# Altium project 175-00060, rev2, NRES Temp Meas, 8-Chan RTD.PrjPcb
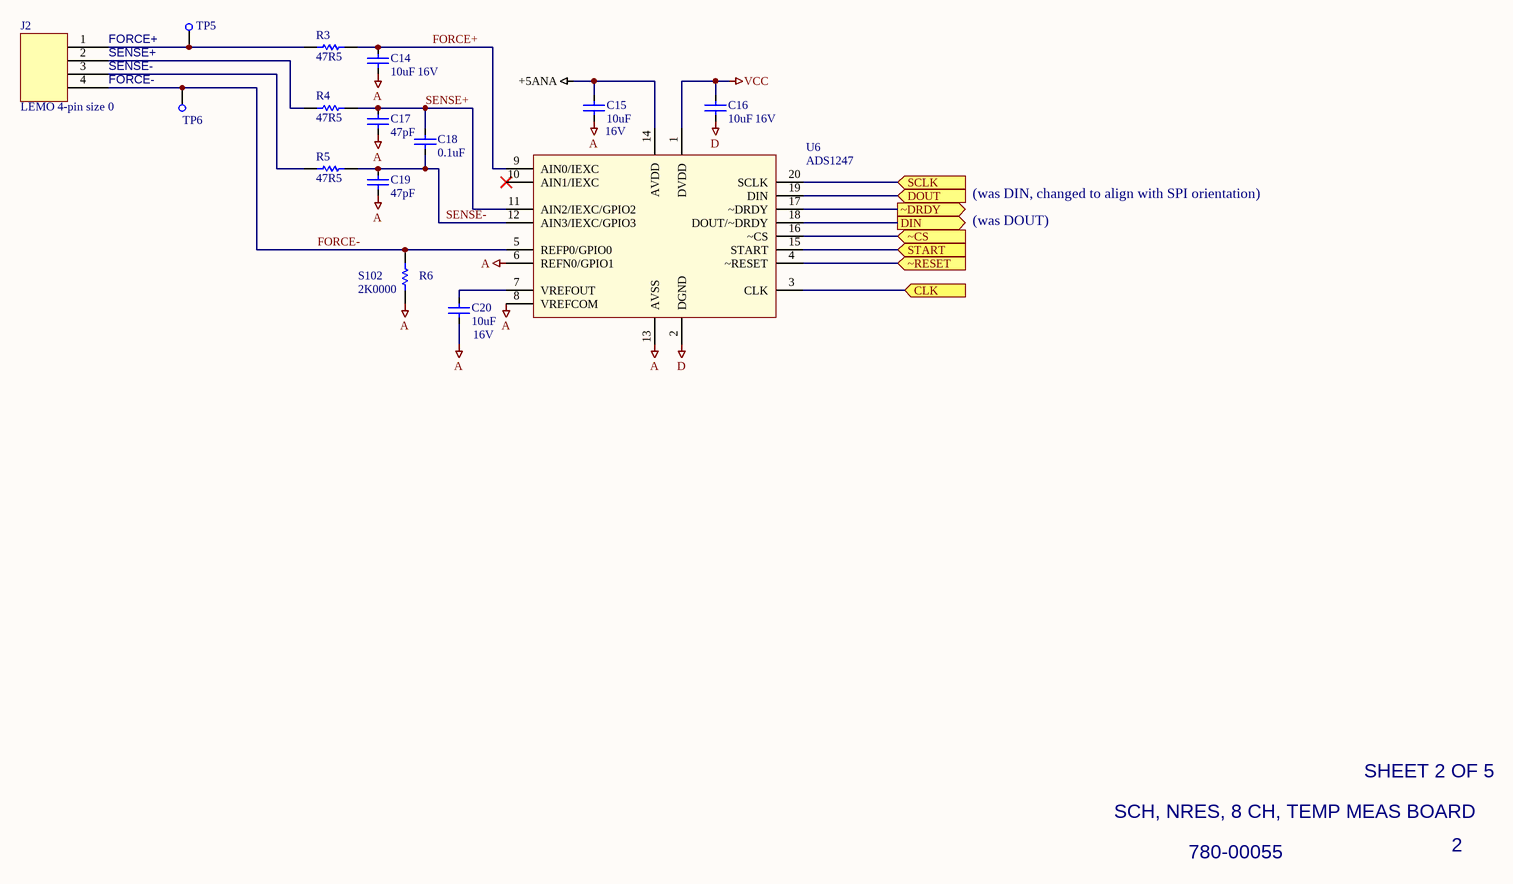
[diagram p0: 780-00055, rev2, Pg2, SCH, NRES Temp Meas, 8-Chan RTD .SchDoc]
4 sheets, 79 parts. Net scope: flat (ports and power ports of the same name join across sheets).
Board file: 175-00060, rev2, PCB, NRES RTD_TEC Board.PcbDoc
Sheets:
  780-00055, rev2, Pg2, SCH, NRES Temp Meas, 8-Chan RTD .SchDoc
  780-00055, rev2, Pg3, SCH, NRES Temp Meas, 8-Chan RTD .SchDoc
  780-00055, rev2, Pg4, SCH, NRES Temp Meas, 8-Chan RTD .SchDoc
  780-00055, rev2, Pg5, SCH, NRES Temp Meas, 8-Chan RTD .SchDoc

## Sheet 780-00055, rev2, Pg2, SCH, NRES Temp Meas, 8-Chan RTD .SchDoc
size B; PageSetup: Record=PageOptions|CenterHorizontal=True|CenterVertical=True|PrintScale=1.12|XCorrection=1.00|YCorrection=1.00|PrintKind=0|BorderSize=5000000|LeftOffset=0|BottomOffset=0|Orientation=2|PaperLength=1000|PaperWidth=1000|Scale=100|PaperSource=15|PrintQuality=600|MediaType=1|DitherType=10|PrintScaleMode=1|PaperKind=Tabloid|PaperIndex=3

### Parts
C14  16V  value 10uF  [SMD_0805]
C15  16V  value 10uF  [SMD_0805]
C16  16V  value 10uF  [SMD_0805]
C17  value 47pF  [SMD_0805]  (hidden comment: Cap SMD)
C18  value 0.1uF  [SMD_0805]  (hidden comment: Cap SMD)
C19  value 47pF  [SMD_0805]  (hidden comment: Cap SMD)
C20  16V  value 10uF  [SMD_0805]
J2  LEMO 4-pin size 0  [LEMO Size 0, 4-pin PCB]
R3  value 47R5  [SMD_0805]  (hidden comment: Res 0805)
R4  value 47R5  [SMD_0805]  (hidden comment: Res 0805)
R5  value 47R5  [SMD_0805]  (hidden comment: Res 0805)
R6  S102  value 2K0000  [Vishay S102 series]
TP5  Test point  [PAD_80D_052H]  (value not drawn)
TP6  Test point  [PAD_80D_052H]  (value not drawn)
U6  ADS1247  [TSSOP20]

### Ports
CLK (in), DIN (out), DOUT (in), SCLK (in), START (in), ~CS (in), ~DRDY (out), ~RESET (in)

### Nets
+5ANA: C15.2 U6.14(AVDD)
A: C14.1 C15.1 C17.1 C19.1 C20.1 R6.1 U6.6(REFN0/GPIO1) U6.8(VREFCOM) U6.13(AVSS)
D: C16.1 U6.2(DGND)
VCC: C16.2 U6.1(DVDD)
DOUT: U6.19(DIN) ; port DOUT
FORCE+: C14.2 R3.2 U6.9(AIN0/IEXC)
FORCE-: J2.4(S32) R6.2 TP6.1(TP) U6.5(REFP0/GPIO0)
SCLK: U6.20(SCLK) ; port SCLK
SENSE+: C17.2 C18.2 R4.2 U6.11(AIN2/IEXC/GPIO2)
SENSE-: C18.1 C19.2 R5.2 U6.12(AIN3/IEXC/GPIO3)
START: U6.15(START) ; port START
~DRDY: U6.17(~DRDY) ; port ~DRDY
NetC20_2: C20.2 U6.7(VREFOUT)
NetJ2_1: J2.1(S29) R3.1 TP5.1(TP)
NetJ2_2: J2.2(S30) R4.1
NetJ2_3: J2.3(S31) R5.1
NetU6_3: U6.3(CLK) ; port CLK
NetU6_4: U6.4(~RESET) ; port ~RESET
NetU6_16: U6.16(~CS) ; port ~CS
NetU6_18: U6.18(DOUT/~DRDY) ; port DIN

Not connected (* = marked no-connect by the designer): U6 10(AIN1/IEXC)*

### Notes on the sheet
- FORCE+
- SENSE+
- SENSE-
- FORCE-
- (was DIN, changed to align with SPI orientation)
- (was DOUT)
- SCH, NRES, 8 CH, TEMP MEAS BOARD
- SHEET 2 OF 5
- 780-00055
- 2

### Library data of the parts
C14-C16 C20 = Cap SMD: Capacitor; LCO p/n: 120-00007
C17 C19 = Cap SMD: Capacitor; LCO p/n: 120-00056
C18 = Cap SMD: Capacitor; LCO p/n: 120-00002
J2 = LEMO Size 0, 4 pin, PCB: LCO p/n: 125-00372
R3-R5 = Res SMD: Resistor 0805; Manufacturer: Vishay/Dale; Manuf p/n: CRCW080547R5FKEA; Vendor: DIGIKEY; Vendor p/n: 541-47R5CCT-ND; Vendor Mult.: 10; LCO p/n: 181-047R5; COST: 0.09
R6 = RES TH Radial: Vishay Foil Resistor; LCO p/n: 180-00011
TP5 TP6 = Test point: Manufacturer: Keystone; Manuf p/n: 1249; Vendor: Bisco Ind.; LCO p/n: 125-00013; Vendor p/n: 1249; COST: 0.18; VALUE: Test point
U6 = ADS1247: 24bit ADC for Temp Sensors; Manufacturer: TI; Manuf p/n: ADS1247IPW; LCO p/n: 150-00106; Vendor: DK; Vendor p/n: 296-24293-5-ND

## Sheet 780-00055, rev2, Pg3, SCH, NRES Temp Meas, 8-Chan RTD .SchDoc
size B; PageSetup: Record=PageOptions|CenterHorizontal=True|CenterVertical=True|PrintScale=1.12|XCorrection=1.00|YCorrection=1.00|PrintKind=0|BorderSize=5000000|LeftOffset=0|BottomOffset=0|Orientation=2|PaperLength=1000|PaperWidth=1000|Scale=100|PaperSource=15|PrintQuality=600|MediaType=1|DitherType=10|PrintScaleMode=1|PaperKind=Tabloid|PaperIndex=3
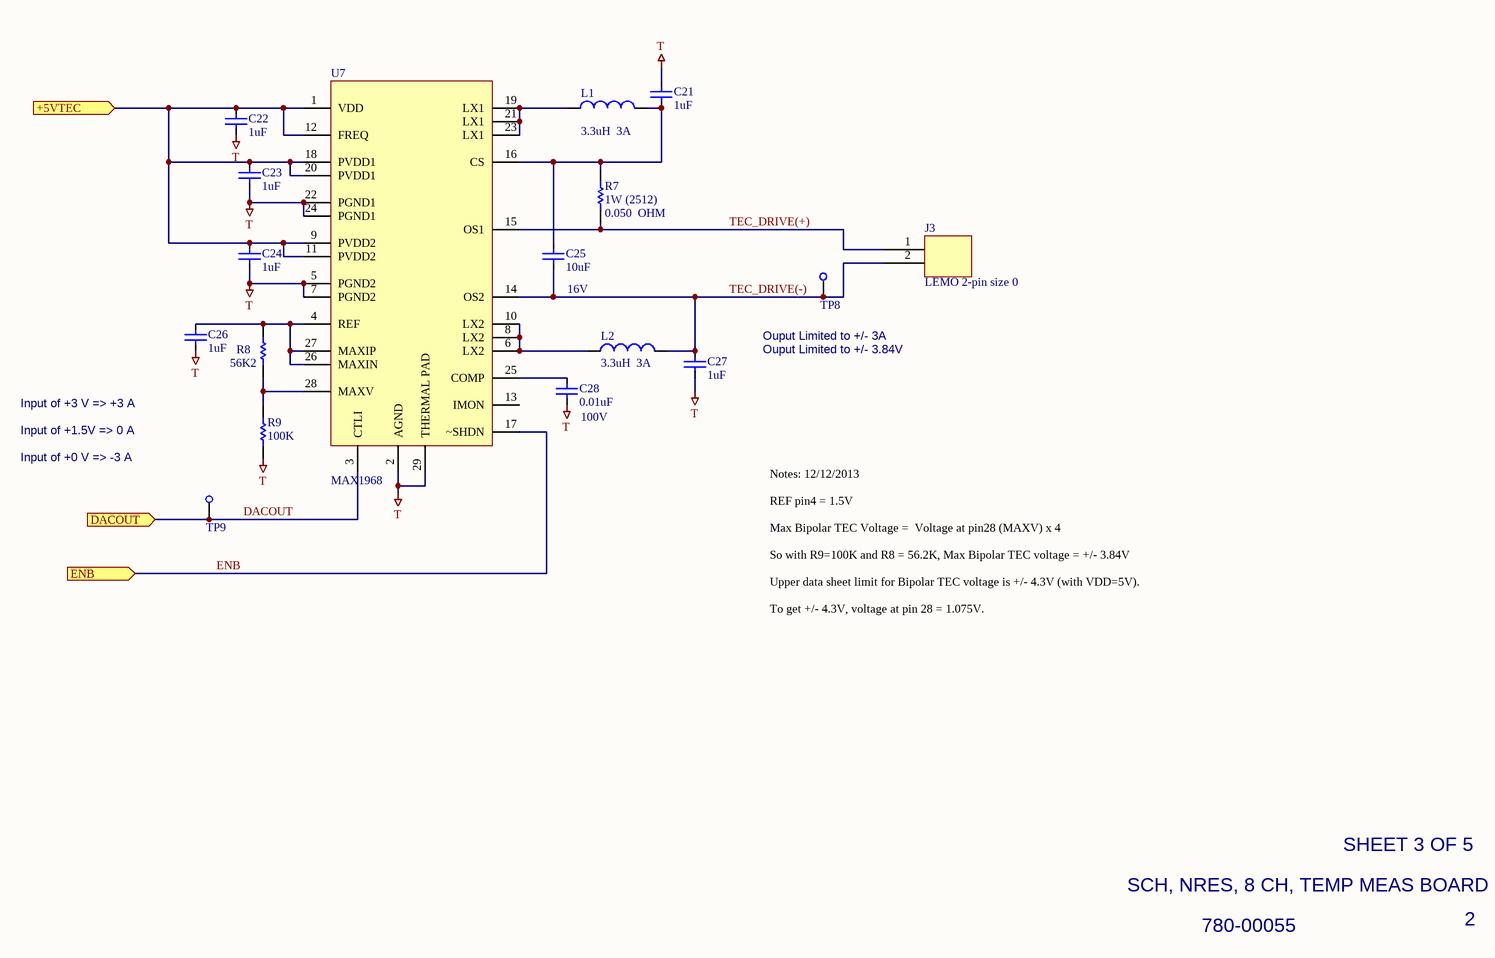
[diagram p1: 780-00055, rev2, Pg3, SCH, NRES Temp Meas, 8-Chan RTD .SchDoc]

### Parts
C21  value 1uF  [SMD_0805]  (hidden comment: Cap SMD)
C22  value 1uF  [SMD_0805]  (hidden comment: Cap SMD)
C23  value 1uF  [SMD_0805]  (hidden comment: Cap SMD)
C24  value 1uF  [SMD_0805]  (hidden comment: Cap SMD)
C25  16V  value 10uF  [SMD_0805]
C26  value 1uF  [SMD_0805]  (hidden comment: Cap SMD)
C27  value 1uF  [SMD_0805]  (hidden comment: Cap SMD)
C28  100V  value 0.01uF  [SMD_0805]
J3  LEMO 2-pin size 0  [LEMO Size 0, 2-pin PCB]
L1  value 3.3uH  3A  [SMT Inductor 7 x 7mm]  (hidden comment: 513-1481-2-ND)
L2  value 3.3uH  3A  [SMT Inductor 7 x 7mm]  (hidden comment: 513-1481-2-ND)
R7  1W (2512)  value 0.050  OHM  [6332[2512]]
R8  value 56K2  [SMD_0805]  (hidden comment: Res 0805)
R9  value 100K  [SMD_0805]  (hidden comment: Res 0805)
TP8  Test point  [PAD_80D_052H]  (value not drawn)
TP9  Test point  [PAD_80D_052H]  (value not drawn)
U7  MAX1968  [TSSOP28 Exposed Pad]

### Ports
+5VTEC (in), DACOUT (in), ENB (in)

### Nets
T: C21.2 C22.1 C23.1 C24.1 C26.1 C27.1 C28.1 R9.1 U7.2(AGND) U7.5(PGND2) U7.7(PGND2) U7.22(PGND1) U7.24(PGND1) U7.29(THERMAL_PAD)
DACOUT: TP9.1(TP) U7.3(CTLI) ; port DACOUT
ENB: U7.17(~SHDN) ; port ENB
TEC_DRIVE(+): J3.1(S29) R7.1 U7.15(OS1)
TEC_DRIVE(-): C25.1 C27.2 J3.2(S30) L2.2 TP8.1(TP) U7.14(OS2)
NetC21_1: C21.1 C25.2 L1.2 R7.2 U7.16(CS)
NetC22_2: C22.2 C23.2 C24.2 U7.1(VDD) U7.9(PVDD2) U7.11(PVDD2) U7.12(FREQ) U7.18(PVDD1) U7.20(PVDD1) ; port +5VTEC
NetC26_2: C26.2 R8.2 U7.4(REF) U7.26(MAXIN) U7.27(MAXIP)
NetC28_2: C28.2 U7.25(COMP)
NetL1_1: L1.1 U7.19(LX1) U7.21(LX1) U7.23(LX1)
NetL2_1: L2.1 U7.6(LX2) U7.8(LX2) U7.10(LX2)
NetR8_1: R8.1 R9.2 U7.28(MAXV)

Not connected (* = marked no-connect by the designer): U7 13(IMON)

### Notes on the sheet
- Ouput Limited to +/- 3A
- Ouput Limited to +/- 3.84V
- Input of +3 V => +3 A
- Input of +1.5V => 0 A
- Input of +0 V => -3 A
- Notes: 12/12/2013
  REF pin4 = 1.5V
  Max Bipolar TEC Voltage =  Voltage at pin28 (MAXV) x 4
  So with R9=100K and R8 = 56.2K, Max Bipolar TEC voltage = +/- 3.84V
  Upper data sheet limit for Bipolar TEC voltage is +/- 4.3V (with VDD=5V).
  To get +/- 4.3V, voltage at pin 28 = 1.075V.
- SCH, NRES, 8 CH, TEMP MEAS BOARD
- SHEET 3 OF 5
- 780-00055
- 2

### Library data of the parts
C21-C24 C26 C27 = Cap SMD: Capacitor; LCO p/n: 120-00006
C25 = Cap SMD: Capacitor; LCO p/n: 120-00007
C28 = Cap SMD: Capacitor; Manufacturer: Johanson; Manuf p/n: 101X15W103MV4E; Vendor: Digi-Key; Vendor p/n: 709-1325-1-ND; LCO p/n: 120-00050
J3 = LEMO Size 0, 2 pin, PCB: LCO p/n: 125-00371
L1 L2 = Inductor SMD 7 x 7mm: Inductor; Manufacturer: Coiltronics; Manuf p/n: SD7030-3R3-R; Vendor: Digi-Key; Vendor Mult.: 1; LCO p/n: 155-00007; Vendor p/n: 513-1481-2-ND; COST: 1.03
R7 = Res SMD: Manufacturer: Panasonic; Manuf p/n: ERJ-L1WKF50MU; Vendor: DIGIKEY; Vendor p/n: P50MCT-ND; Vendor Mult.: 1; LCO p/n: 180-00014; COST: 1.07
R8 = Res SMD: Resistor 0805; Manufacturer: Vishay/Dale; Manuf p/n: CRCW080556K2FKEA; Vendor: DIGIKEY; Vendor p/n: 541-56K2CCT-ND; Vendor Mult.: 10; LCO p/n: 181-05622; COST: 0.09
R9 = Res SMD: Resistor 0805; Manufacturer: Vishay/Dale; Manuf p/n: CRCW0805100KFKEA; Vendor: DIGIKEY; Vendor p/n: 541-100KCCT-ND; Vendor Mult.: 10; LCO p/n: 181-01003; COST: 0.09
TP8 TP9 = Test point: as TP5 on sheet 780-00055, rev2, Pg2, SCH, NRES Temp Meas, 8-Chan RTD ; Vendor p/n: 1249; COST: 0.18; VALUE: Test point
U7 = MAX1968: TEC Driver +/- 3A; Manufacturer: Maxim; Manuf p/n: MAX1968EUI+; LCO p/n: 150-00096; Vendor: digikey; Vendor p/n: MAX1968EUI+-ND; VALUE: MAX1968

## Sheet 780-00055, rev2, Pg4, SCH, NRES Temp Meas, 8-Chan RTD .SchDoc
size B; PageSetup: Record=PageOptions|CenterHorizontal=True|CenterVertical=True|PrintScale=1.12|XCorrection=1.00|YCorrection=1.00|PrintKind=0|BorderSize=5000000|LeftOffset=0|BottomOffset=0|Orientation=2|PaperLength=1000|PaperWidth=1000|Scale=100|PaperSource=15|PrintQuality=600|MediaType=1|DitherType=10|PrintScaleMode=1|PaperKind=Tabloid|PaperIndex=3
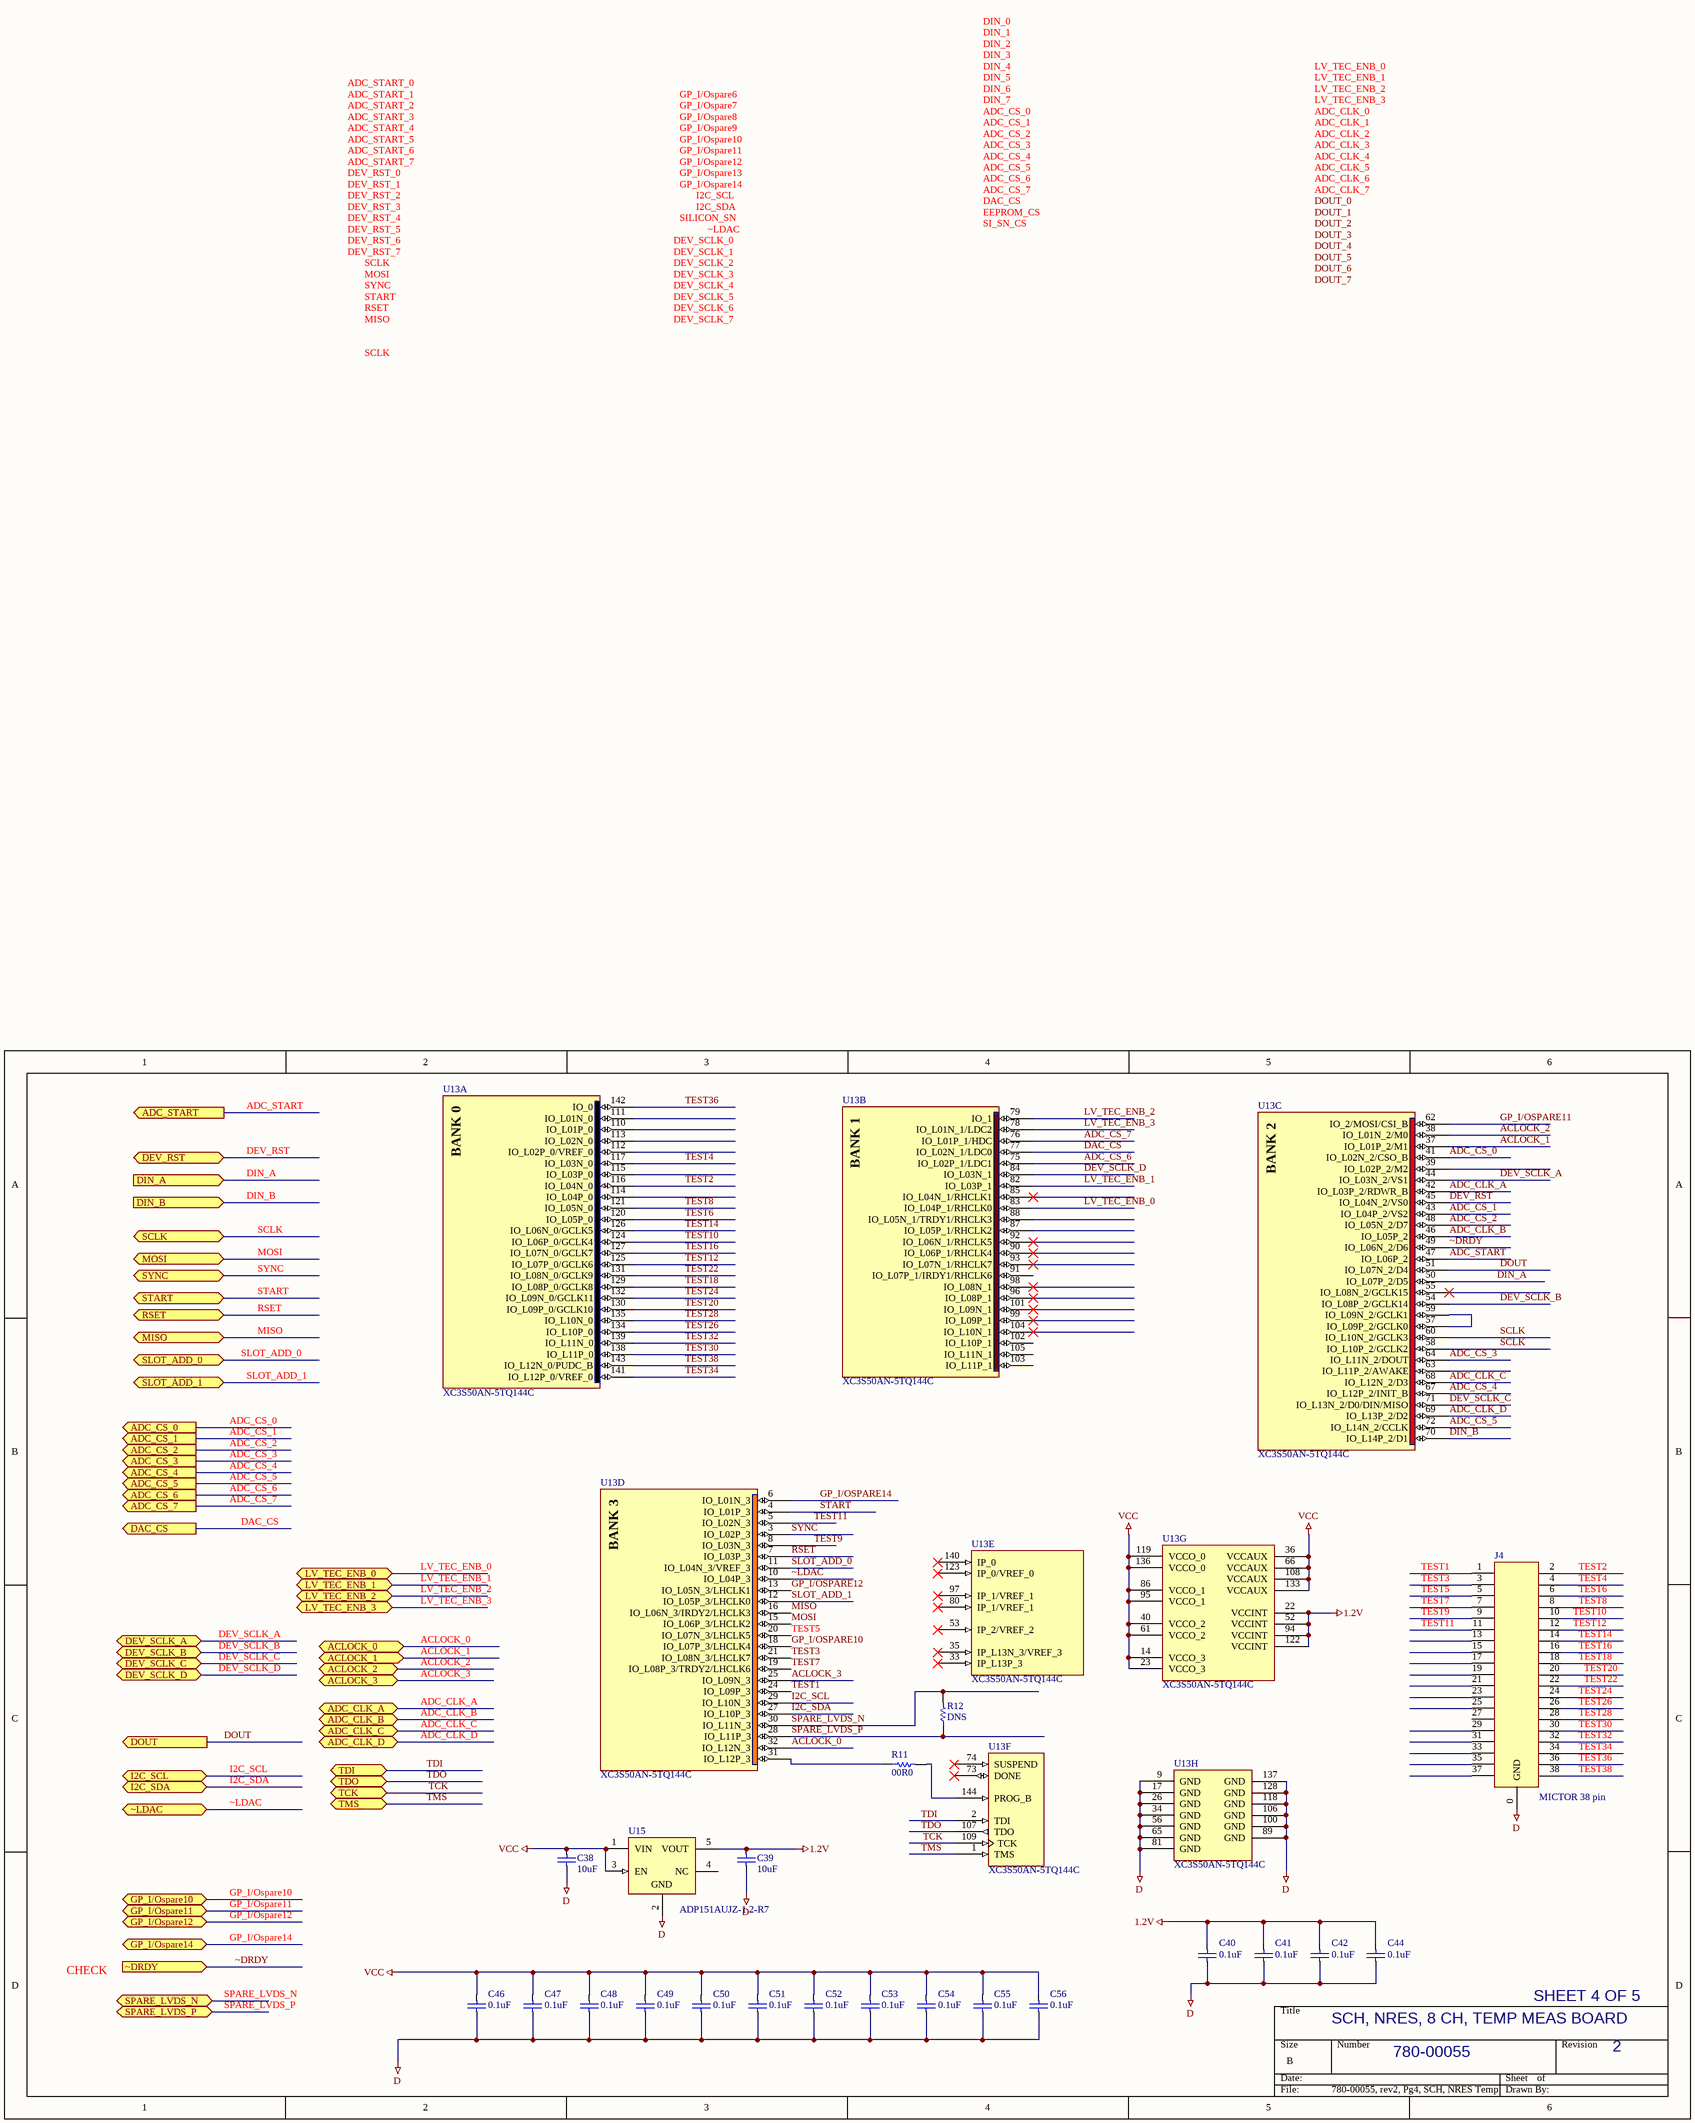
[diagram p2: 780-00055, rev2, Pg4, SCH, NRES Temp Meas, 8-Chan RTD .SchDoc]

### Parts
C38  value 10uF  [smd_0805]  (hidden comment: Cap SMD)
C39  value 10uF  [smd_0805]  (hidden comment: Cap SMD)
C40  value 0.1uF  [SMD_0805]  (hidden comment: Cap SMD)
C41  value 0.1uF  [SMD_0805]  (hidden comment: Cap SMD)
C42  value 0.1uF  [SMD_0805]  (hidden comment: Cap SMD)
C44  value 0.1uF  [SMD_0805]  (hidden comment: Cap SMD)
C46  value 0.1uF  [SMD_0805]  (hidden comment: Cap SMD)
C47  value 0.1uF  [SMD_0805]  (hidden comment: Cap SMD)
C48  value 0.1uF  [SMD_0805]  (hidden comment: Cap SMD)
C49  value 0.1uF  [SMD_0805]  (hidden comment: Cap SMD)
C50  value 0.1uF  [SMD_0805]  (hidden comment: Cap SMD)
C51  value 0.1uF  [SMD_0805]  (hidden comment: Cap SMD)
C52  value 0.1uF  [SMD_0805]  (hidden comment: Cap SMD)
C53  value 0.1uF  [SMD_0805]  (hidden comment: Cap SMD)
C54  value 0.1uF  [SMD_0805]  (hidden comment: Cap SMD)
C55  value 0.1uF  [SMD_0805]  (hidden comment: Cap SMD)
C56  value 0.1uF  [SMD_0805]  (hidden comment: Cap SMD)
J4  MICTOR 38 pin  [MICTOR 38 pin connector]
R11  value 00R0  [SMD_0805]  (hidden comment: Res 0805)
R12  value DNS  [SMD_0805]  (hidden comment: Res 0805)
U13  XC3S50AN-5TQ144C  [TQ144_N]  (parts A,B,C,D,E,F,G,H of 8)
U15  ADP151AUJZ-1.2-R7  [ADI-UJ-5_N]

### Ports
ACLOCK_0, ACLOCK_1, ACLOCK_2, ACLOCK_3, ADC_CLK_A, ADC_CLK_B, ADC_CLK_C, ADC_CLK_D, ADC_CS_0 (out), ADC_CS_1 (out), ADC_CS_2 (out), ADC_CS_3 (out), ADC_CS_4 (out), ADC_CS_5 (out), ADC_CS_6 (out), ADC_CS_7 (out), ADC_START (out), DAC_CS (out), DEV_RST, DEV_SCLK_A, DEV_SCLK_B, DEV_SCLK_C, DEV_SCLK_D, DIN_A (in), DIN_B (in), DOUT (out), GP_I/Ospare10, GP_I/Ospare11, GP_I/Ospare12, GP_I/Ospare14, I2C_SCL, I2C_SDA, LV_TEC_ENB_0, LV_TEC_ENB_1, LV_TEC_ENB_2, LV_TEC_ENB_3, MISO, MOSI, RSET, SCLK, SLOT_ADD_0, SLOT_ADD_1, SPARE_LVDS_N, SPARE_LVDS_P, START, SYNC, TCK, TDI, TDO, TMS, ~DRDY (in), ~LDAC

### Nets
1.2V: C39.2 C40.2 C41.2 C42.2 C44.2 U13.22(VCCINT) U13.52(VCCINT) U13.94(VCCINT) U13.122(VCCINT) U15.5(VOUT)
D: C38.1 C39.1 C40.1 C41.1 C42.1 C44.1 C46.1 C47.1 C48.1 C49.1 C50.1 C51.1 C52.1 C53.1 C54.1 C55.1 C56.1 J4.0(GND) U13.9(GND) U13.17(GND) U13.26(GND) U13.34(GND) U13.56(GND) U13.65(GND) U13.81(GND) U13.89(GND) U13.100(GND) U13.106(GND) U13.118(GND) U13.128(GND) U13.137(GND) U15.2(GND)
VCC: C38.2 C46.2 C47.2 C48.2 C49.2 C50.2 C51.2 C52.2 C53.2 C54.2 C55.2 C56.2 U13.14(VCCO_3) U13.23(VCCO_3) U13.36(VCCAUX) U13.40(VCCO_2) U13.61(VCCO_2) U13.66(VCCAUX) U13.86(VCCO_1) U13.95(VCCO_1) U13.108(VCCAUX) U13.119(VCCO_0) U13.133(VCCAUX) U13.136(VCCO_0) U15.1(VIN) U15.3(EN)
ACLOCK_0: U13.32(IO_L12N_3) ; port ACLOCK_0
ACLOCK_1: U13.37(IO_L01P_2/M1) ; port ACLOCK_1
ACLOCK_2: U13.38(IO_L01N_2/M0) ; port ACLOCK_2
ACLOCK_3: U13.25(IO_L09N_3) ; port ACLOCK_3
ADC_CLK_A: U13.42(IO_L03P_2/RDWR_B) ; port ADC_CLK_A
ADC_CLK_B: U13.46(IO_L05P_2) ; port ADC_CLK_B
ADC_CLK_C: U13.68(IO_L12N_2/D3) ; port ADC_CLK_C
ADC_CLK_D: U13.69(IO_L13P_2/D2) ; port ADC_CLK_D
ADC_CS_0: U13.41(IO_L02N_2/CSO_B) ; port ADC_CS_0
ADC_CS_1: U13.43(IO_L04P_2/VS2) ; port ADC_CS_1
ADC_CS_2: U13.48(IO_L05N_2/D7) ; port ADC_CS_2
ADC_CS_3: U13.64(IO_L11N_2/DOUT) ; port ADC_CS_3
ADC_CS_4: U13.67(IO_L12P_2/INIT_B) ; port ADC_CS_4
ADC_CS_5: U13.72(IO_L14N_2/CCLK) ; port ADC_CS_5
ADC_CS_6: U13.75(IO_L02P_1/LDC1) ; port ADC_CS_6
ADC_CS_7: U13.76(IO_L01P_1/HDC) ; port ADC_CS_7
ADC_START: U13.47(IO_L06P_2) ; port ADC_START
DAC_CS: U13.77(IO_L02N_1/LDC0) ; port DAC_CS
DEV_RST: U13.45(IO_L04N_2/VS0) ; port DEV_RST
DEV_SCLK_A: U13.44(IO_L03N_2/VS1) ; port DEV_SCLK_A
DEV_SCLK_B: U13.54(IO_L08P_2/GCLK14) ; port DEV_SCLK_B
DEV_SCLK_C: U13.71(IO_L13N_2/D0/DIN/MISO) ; port DEV_SCLK_C
DEV_SCLK_D: U13.84(IO_L03N_1) ; port DEV_SCLK_D
DIN_A: U13.50(IO_L07P_2/D5) ; port DIN_A
DIN_B: U13.70(IO_L14P_2/D1) ; port DIN_B
DOUT: U13.51(IO_L07N_2/D4) ; port DOUT
GP_I/Ospare10: U13.18(IO_L07P_3/LHCLK4) ; port GP_I/Ospare10
GP_I/Ospare11: U13.62(IO_2/MOSI/CSI_B) ; port GP_I/Ospare11
GP_I/Ospare12: U13.13(IO_L05N_3/LHCLK1) ; port GP_I/Ospare12
GP_I/Ospare14: U13.6(IO_L01N_3) ; port GP_I/Ospare14
I2C_SCL: U13.29(IO_L10N_3) ; port I2C_SCL
I2C_SDA: U13.27(IO_L10P_3) ; port I2C_SDA
LV_TEC_ENB_0: U13.83(IO_L04P_1/RHCLK0) ; port LV_TEC_ENB_0
LV_TEC_ENB_1: U13.82(IO_L03P_1) ; port LV_TEC_ENB_1
LV_TEC_ENB_2: U13.79(IO_1) ; port LV_TEC_ENB_2
LV_TEC_ENB_3: U13.78(IO_L01N_1/LDC2) ; port LV_TEC_ENB_3
MISO: U13.16(IO_L06N_3/IRDY2/LHCLK3) ; port MISO
MOSI: U13.15(IO_L06P_3/LHCLK2) ; port MOSI
RSET: U13.7(IO_L03P_3) ; port RSET
SCLK: U13.58(IO_L10P_2/GCLK2) U13.60(IO_L10N_2/GCLK3) ; port SCLK
SLOT_ADD_0: U13.11(IO_L04N_3/VREF_3) ; port SLOT_ADD_0
SLOT_ADD_1: U13.12(IO_L05P_3/LHCLK0) ; port SLOT_ADD_1
SPARE_LVDS_N: R12.2 U13.30(IO_L11N_3) ; port SPARE_LVDS_N
SPARE_LVDS_P: R12.1 U13.28(IO_L11P_3) ; port SPARE_LVDS_P
START: U13.4(IO_L01P_3) ; port START
SYNC: U13.3(IO_L02P_3) ; port SYNC
TCK: U13.109(TCK) ; port TCK
TDI: U13.2(TDI) ; port TDI
TDO: U13.107(TDO) ; port TDO
TEST1: J4.1(display) U13.24(IO_L09P_3)
TEST2: J4.2(conn) U13.116(IO_L04N_0)
TEST3: J4.3(conn) U13.21(IO_L08N_3/LHCLK7)
TEST4: J4.4(conn) U13.117(IO_L03N_0)
TEST5: J4.5(conn) U13.20(IO_L07N_3/LHCLK5)
TEST6: J4.6(conn) U13.120(IO_L05P_0)
TEST7: J4.7(conn) U13.19(IO_L08P_3/TRDY2/LHCLK6)
TEST8: J4.8(conn) U13.121(IO_L05N_0)
TEST9: J4.9(conn) U13.8(IO_L03N_3)
TEST10: J4.10(conn) U13.124(IO_L06P_0/GCLK4)
TEST11: J4.11(conn) U13.5(IO_L02N_3)
TEST12: J4.12(conn) U13.125(IO_L07P_0/GCLK6)
TEST14: J4.14(conn) U13.126(IO_L06N_0/GCLK5)
TEST16: J4.16(conn) U13.127(IO_L07N_0/GCLK7)
TEST18: J4.18(conn) U13.129(IO_L08P_0/GCLK8)
TEST20: J4.20(conn) U13.130(IO_L09P_0/GCLK10)
TEST22: J4.22(conn) U13.131(IO_L08N_0/GCLK9)
TEST24: J4.24(conn) U13.132(IO_L09N_0/GCLK11)
TEST26: J4.26(conn) U13.134(IO_L10P_0)
TEST28: J4.28(conn) U13.135(IO_L10N_0)
TEST30: J4.30(conn) U13.138(IO_L11P_0)
TEST32: J4.32(conn) U13.139(IO_L11N_0)
TEST34: J4.34(conn) U13.141(IO_L12P_0/VREF_0)
TEST36: J4.36(conn) U13.142(IO_0)
TEST38: J4.38(conn) U13.143(IO_L12N_0/PUDC_B)
TMS: U13.1(TMS) ; port TMS
~DRDY: U13.49(IO_L06N_2/D6) ; port ~DRDY
~LDAC: U13.10(IO_L04P_3) ; port ~LDAC
NetR11_1: R11.1 U13.31(IO_L12P_3)
NetR11_2: R11.2 U13.144(PROG_B)
NetU13_57: U13.57(IO_L09P_2/GCLK0) U13.59(IO_L09N_2/GCLK1)

Not connected (* = marked no-connect by the designer): J4 13(conn) 15(conn) 17(conn) 19(conn) 21(conn) 23(conn) 25(conn) 27(conn) 29(conn) 31(conn) 33(conn) 35(conn) 37(conn); U13 33(IP_L13P_3)* 35(IP_L13N_3/VREF_3)* 39(IO_L02P_2/M2) 53(IP_2/VREF_2)* 55(IO_L08N_2/GCLK15)* 63(IO_L11P_2/AWAKE) 73(DONE)* 74(SUSPEND)* 80(IP_1/VREF_1)* 85(IO_L04N_1/RHCLK1)* 87(IO_L05P_1/RHCLK2) 88(IO_L05N_1/TRDY1/RHCLK3) 90(IO_L06P_1/RHCLK4)* 91(IO_L07P_1/IRDY1/RHCLK6) 92(IO_L06N_1/RHCLK5)* 93(IO_L07N_1/RHCLK7)* 96(IO_L08P_1)* 97(IP_1/VREF_1)* 98(IO_L08N_1)* 99(IO_L09P_1)* 101(IO_L09N_1)* 102(IO_L10P_1) 103(IO_L11P_1) 104(IO_L10N_1)* 105(IO_L11N_1) 110(IO_L01P_0) 111(IO_L01N_0) 112(IO_L02P_0/VREF_0) 113(IO_L02N_0) 114(IO_L04P_0) 115(IO_L03P_0) 123(IP_0/VREF_0)* 140(IP_0)*; U15 4(NC)

### Notes on the sheet
- CHECK
- SCH, NRES, 8 CH, TEMP MEAS BOARD
- SHEET 4 OF 5
- 780-00055
- 2
- Labels drawn without touching a wire or pin: ADC_CLK_0, ADC_CLK_1, ADC_CLK_2, ADC_CLK_3, ADC_CLK_4, ADC_CLK_5, ADC_CLK_6, ADC_CLK_7, ADC_CS_0, ADC_CS_1, ADC_CS_2, ADC_CS_3, ADC_CS_4, ADC_CS_5, ADC_CS_6, ADC_CS_7, ADC_START_0, ADC_START_1, ADC_START_2, ADC_START_3, ADC_START_4, ADC_START_5, ADC_START_6, ADC_START_7, DAC_CS, DEV_RST_0, DEV_RST_1, DEV_RST_2, DEV_RST_3, DEV_RST_4, DEV_RST_5, DEV_RST_6, DEV_RST_7, DEV_SCLK_0, DEV_SCLK_1, DEV_SCLK_2, DEV_SCLK_3, DEV_SCLK_4, DEV_SCLK_5, DEV_SCLK_6, DEV_SCLK_7, DIN_0, DIN_1, DIN_2, DIN_3, DIN_4, DIN_5, DIN_6, DIN_7, DOUT_0, DOUT_1, DOUT_2, DOUT_3, DOUT_4, DOUT_5, DOUT_6, DOUT_7, EEPROM_CS, GP_I/Ospare6, GP_I/Ospare7, GP_I/Ospare8, GP_I/Ospare9, GP_I/Ospare10, GP_I/Ospare11, GP_I/Ospare12, GP_I/Ospare13, GP_I/Ospare14, I2C_SCL, I2C_SDA, LV_TEC_ENB_0, LV_TEC_ENB_1, LV_TEC_ENB_2, LV_TEC_ENB_3, MISO, MOSI, RSET, SCLK, SI_SN_CS, SILICON_SN, START, SYNC, ~LDAC
- (in symbol XC3S50AN-5TQ144C, part A) BANK 0
- (in symbol XC3S50AN-5TQ144C, part B) BANK 1
- (in symbol XC3S50AN-5TQ144C, part C) BANK 2
- (in symbol XC3S50AN-5TQ144C, part D) BANK 3

### Library data of the parts
C38 C39 = Cap SMD: Capacitor; LCO p/n: 120-00005
C40-C42 C44 C46-C56 = Cap SMD: Capacitor; LCO p/n: 120-00002
J4 = MICTOR Adapter: 38 pin MICTOR Adapter; Manufacturer: TE Connectivity; Manuf p/n: 2-767004-2; LCO p/n: 125-00397; VALUE: 38pin; Vendor: Mouser; Vendor p/n: 571-27670042
R11 = Res SMD: Resistor 0805; Manufacturer: Vishay/Dale; Manuf p/n: CRCW080500R0FKEA; Vendor: DIGIKEY; Vendor p/n: 541-00R0CCT-ND; Vendor Mult.: 10; LCO p/n: 180-00046; COST: 0.09
R12 = Res SMD: Resistor 0805; Manufacturer: Vishay/Dale; Manuf p/n: CRCW0805DNSFKEA; Vendor: DIGIKEY; Vendor p/n: 541-DNSCCT-ND; Vendor Mult.: 10; LCO p/n: 160-00022; COST: 0.09
U13 = XC3S50AN-5TQ144C: Spartan-3AN Non-Volatile FPGA, 108 User I/Os, 144-Pin TQFP, High Performance, Commercial Grade; LCO p/n: 150-00114; Published: 20-Jul-2007; LatestRevisionDate: 01-Mar-2010; LatestRevisionNote: Updated to datasheet version 3.2 Nov-2009; DatasheetVersion: ver 3.2, Nov-2009; PackageVersion: ver1.2, Jun-2004; PackageReference: TQ144; Publisher: Altium Limited; PackageDescription: 144-Pin Thin Quad Flat Pack (TQ144); Code_JEDEC: MS-026-BFB; ComponentLink1Description: Spartan-3AN Datasheet; ComponentLink1URL: http://www.xilinx.com/support/documentation/data_sheets/ds557.pdf; ComponentLink2Description: TQ144 Package Drawing; ComponentLink2URL: http://www.xilinx.com/support/documentation/package_specs/tq144.pdf; ComponentLink3Description: Spartan-3AN Documents; ComponentLink3URL: http://www.xilinx.com/support/documentation/spartan-3an.htm; ComponentLink4Description: Xilinx.com Home; ComponentLink4URL: http://www.xilinx.com
U15 = CMP-0786-00393-1: Ultralow Noise, 200 mA, CMOS Linear Regulator, 2.2 to 5.5 V Vin, 1.2 V Vout, Industrial, 5-pin SOT23 (UJ-5), Reel; Manufacturer: Analog Devices; Iout max: 200mA; Preset Vout Values (V): 1.2; Vin (max) (V): 5.5; Supply Current IGND @ Small Load: 10uA; Vin (min) (V): 2.2; LCO p/n: 150-00115; PackageVersion: 100708-A, 10/2008; ComponentLink2URL: http://www.analog.com/static/imported-files/data_sheets/ADP151.pdf; ComponentLink1Description: Manufacturer URL; Packing: Reel; ComponentLink4URL: Product URL:http://www.analog.com/en/ADP151/productSearch.html; ComponentLink3Description: Package Specification; ComponentLink4Description: URL Link1; ComponentLink2Description: Datasheet; PartNumber: ADP151AUJZ-1.2-R7; Mounting Technology: Surface Mount; Code_JEDEC: MO-193-AB; ComponentLink1URL: http://www.analog.com/en/index.html; PackageDescription: 5-Pin Thin Small Outline Transistor Package, Body 2.9 x 1.6 mm, Pitch 0.95 mm; ComponentLink3URL: http:/www.analog.com/static/imported-files/packages/PKG_PDF/TSOT(UJ)/UJ_5.pdf; DatasheetVersion: Rev. E; PackageReference: UJ-5

## Sheet 780-00055, rev2, Pg5, SCH, NRES Temp Meas, 8-Chan RTD .SchDoc
size B; PageSetup: Record=PageOptions|CenterHorizontal=True|CenterVertical=True|PrintScale=1.12|XCorrection=1.00|YCorrection=1.00|PrintKind=0|BorderSize=5000000|LeftOffset=0|BottomOffset=0|Orientation=2|PaperLength=1000|PaperWidth=1000|Scale=100|PaperSource=15|PrintQuality=600|MediaType=1|DitherType=10|PrintScaleMode=1|PaperKind=Tabloid|PaperIndex=3
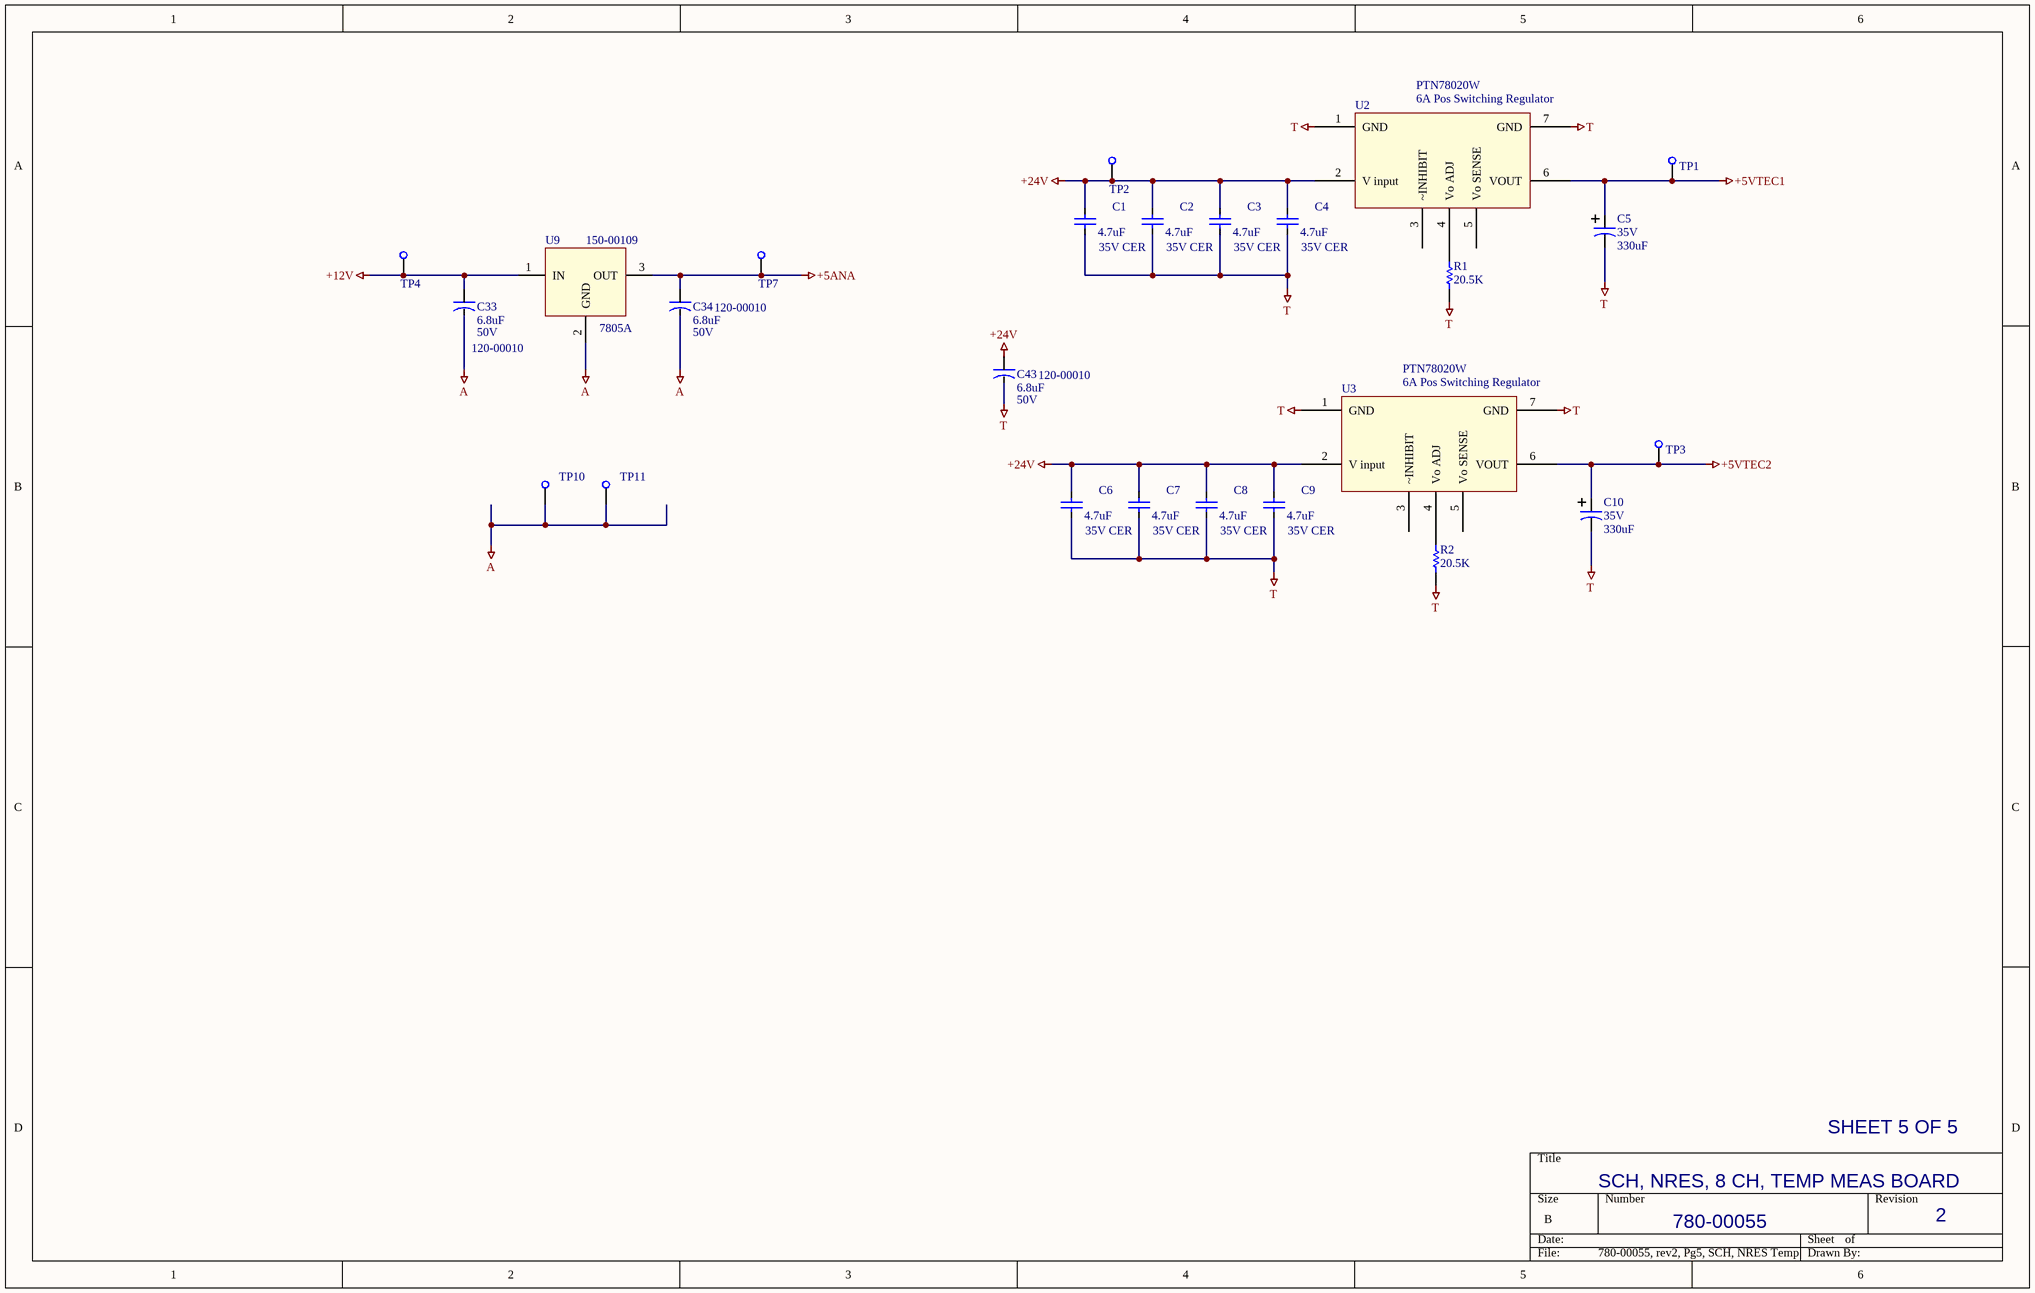
[diagram p3: 780-00055, rev2, Pg5, SCH, NRES Temp Meas, 8-Chan RTD .SchDoc]

### Parts
C1  35V CER  value 4.7uF  [SMD_0805]
C2  35V CER  value 4.7uF  [SMD_0805]
C3  35V CER  value 4.7uF  [SMD_0805]
C4  35V CER  value 4.7uF  [SMD_0805]
C5  35V  value 330uF  [CAP, Thru Hole 10mm dia]
C6  35V CER  value 4.7uF  [SMD_0805]
C7  35V CER  value 4.7uF  [SMD_0805]
C8  35V CER  value 4.7uF  [SMD_0805]
C9  35V CER  value 4.7uF  [SMD_0805]
C10  35V  value 330uF  [CAP, Thru Hole 10mm dia]
C33  50V  value 6.8uF  LCO P/N: 120-00010  [SMD_CAP_6032]
C34  50V  value 6.8uF  LCO P/N: 120-00010  [SMD_CAP_6032]
C43  50V  value 6.8uF  LCO P/N: 120-00010  [SMD_CAP_6032]
R1  value 20.5K  [SMD_0805]  (hidden comment: Res 0805)
R2  value 20.5K  [SMD_0805]  (hidden comment: Res 0805)
TP1  Test point  [PAD_80D_052H]  (value not drawn)
TP2  Test point  [PAD_80D_052H]  (value not drawn)
TP3  Test point  [PAD_80D_052H]  (value not drawn)
TP4  Test point  [PAD_80D_052H]  (value not drawn)
TP7  Test point  [PAD_80D_052H]  (value not drawn)
TP10  Test point  [PAD_80D_052H]  (value not drawn)
TP11  Test point  [PAD_80D_052H]  (value not drawn)
U2  6A Pos Switching Regulator  value PTN78020W  [TEXAS Inst Switching Regulator]
U3  6A Pos Switching Regulator  value PTN78020W  [TEXAS Inst Switching Regulator]
U9  value 7805A  LCO p/n: 150-00109  [TO-220 w/Heatsink 7136DG]  (hidden comment: Voltage Reg, Pos Fixed)

### Nets
+5ANA: C34.pos TP7.1(TP) U9.3(OUT)
+5VTEC1: C5.1 TP1.1(TP) U2.6(VOUT)
+5VTEC2: C10.1 TP3.1(TP) U3.6(VOUT)
+12V: C33.pos TP4.1(TP) U9.1(IN)
+24V: C1.2 C2.2 C3.2 C4.2 C6.2 C7.2 C8.2 C9.2 C43.pos TP2.1(TP) U2.2(V_input) U3.2(V_input)
A: C33.neg C34.neg TP10.1(TP) TP11.1(TP) U9.2(GND)
T: C1.1 C2.1 C3.1 C4.1 C5.2 C6.1 C7.1 C8.1 C9.1 C10.2 C43.neg R1.1 R2.1 U2.1(GND) U2.7(GND) U3.1(GND) U3.7(GND)
NetR1_2: R1.2 U2.4(Vo_ADJ)
NetR2_2: R2.2 U3.4(Vo_ADJ)

Not connected (* = marked no-connect by the designer): U2 3(~INHIBIT) 5(Vo_SENSE); U3 3(~INHIBIT) 5(Vo_SENSE)

### Notes on the sheet
- SHEET 5 OF 5
- SCH, NRES, 8 CH, TEMP MEAS BOARD
- 780-00055
- 2

### Library data of the parts
C1-C4 C6-C9 = Cap SMD: Capacitor; LCO p/n: 120-00051
C5 C10 = Cap Elec, 330 uF, 35V: Radial Thru hole; LCO p/n: 120-00053
C33 C34 C43 = Cap Tant 35V: outline 6.0mm x 3.2mm; Manufacturer: AVX; Manuf p/n: TAJC685K050RNJ; Vendor: DigiKey; Vendor p/n: 478-4776-1-ND; Vendor Mult.: 1; COST: 1.55
R1 R2 = Res SMD: Resistor 0805; Manufacturer: Vishay/Dale; Manuf p/n: CRCW080520.5KFKEA; Vendor: DIGIKEY; Vendor p/n: 541-20.5KCCT-ND; Vendor Mult.: 10; LCO p/n: 181-02052; COST: 0.09
TP1-TP4 TP7 TP10 TP11 = Test point: as TP5 on sheet 780-00055, rev2, Pg2, SCH, NRES Temp Meas, 8-Chan RTD ; Vendor p/n: 1249; COST: 0.18; VALUE: Test point
U2 U3 = PTN78020W: Pos Adj Switching Regulator; LCO p/n: 150-00088
U9 = Voltage Reg, Pos Fixed: 7805A; Manufacturer: On Semi; Vendor: Digi-Key; Vendor Mult.: 1; COST: 0.61

## Nets that join several sheets
+5ANA: 780-00055, rev2, Pg2, SCH, NRES Temp Meas, 8-Chan RTD  (C15.2 U6.14), 780-00055, rev2, Pg5, SCH, NRES Temp Meas, 8-Chan RTD  (C34.pos TP7.1 U9.3)
A: 780-00055, rev2, Pg2, SCH, NRES Temp Meas, 8-Chan RTD  (9 pins), 780-00055, rev2, Pg5, SCH, NRES Temp Meas, 8-Chan RTD  (5 pins)
D: 780-00055, rev2, Pg2, SCH, NRES Temp Meas, 8-Chan RTD  (C16.1 U6.2), 780-00055, rev2, Pg4, SCH, NRES Temp Meas, 8-Chan RTD  (32 pins)
T: 780-00055, rev2, Pg3, SCH, NRES Temp Meas, 8-Chan RTD  (14 pins), 780-00055, rev2, Pg5, SCH, NRES Temp Meas, 8-Chan RTD  (17 pins)
VCC: 780-00055, rev2, Pg2, SCH, NRES Temp Meas, 8-Chan RTD  (C16.2 U6.1), 780-00055, rev2, Pg4, SCH, NRES Temp Meas, 8-Chan RTD  (26 pins)
DOUT: 780-00055, rev2, Pg2, SCH, NRES Temp Meas, 8-Chan RTD  (U6.19), 780-00055, rev2, Pg4, SCH, NRES Temp Meas, 8-Chan RTD  (U13.51)
SCLK: 780-00055, rev2, Pg2, SCH, NRES Temp Meas, 8-Chan RTD  (U6.20), 780-00055, rev2, Pg4, SCH, NRES Temp Meas, 8-Chan RTD  (U13.58 U13.60)
START: 780-00055, rev2, Pg2, SCH, NRES Temp Meas, 8-Chan RTD  (U6.15), 780-00055, rev2, Pg4, SCH, NRES Temp Meas, 8-Chan RTD  (U13.4)
~DRDY: 780-00055, rev2, Pg2, SCH, NRES Temp Meas, 8-Chan RTD  (U6.17), 780-00055, rev2, Pg4, SCH, NRES Temp Meas, 8-Chan RTD  (U13.49)